# EAGLE schematic PlacaBase12V (EAGLE 7.3.0)
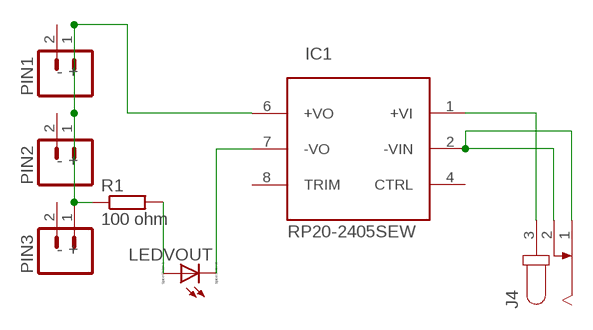
[diagram p0: schematic, sheet 1]

## Parts
IC1  RP20-2405SEW  [PACKAGE_RP20-2405SEW]
J4  JACK-PLUG1  [SPC4078]
LEDVOUT  LED_ELD260  [LED_LD260]
PIN1  M02PTH4  [1X02_XTRA_BIG]
PIN2  M02PTH4  [1X02_XTRA_BIG]
PIN3  M02PTH4  [1X02_XTRA_BIG]
R1  100 ohm  R-EU_0207/5V  [0207/5V]

## Nets
N$1: LEDVOUT.A R1.2
N$2: IC1.6(+VO) PIN1.1 PIN2.1 PIN3.1 R1.1
N$4: IC1.2(-VIN) J4.1 J4.2
N$5: IC1.7(-VO) LEDVOUT.K(C)
N$6: IC1.1(+VI) J4.3
Unconnected: IC1.4(CTRL) IC1.8(TRIM) PIN1.2 PIN2.2 PIN3.2

## Notes on the sheet
- - +
- - +
- - +

## Library data of the parts
IC1 = uchile_robotics_eagle_lib:RP20-2405SEW
J4 = con-jack:JACK-PLUG: DC POWER JACK Power Jack, DC, Right Angle, Through Hole, Rated 5A at 16VDC, PC Terminals Distributor: Farnell (www.Farnell.de) Drawing: 84N1161.pdf / 84N1162.pdf Manufacturer: SPC Technology (www.spctechnology.com) Type: SPC4077 / SPC 4078; OC_FARNELL: unknown; OC_NEWARK: unknown
LEDVOUT = eagle-ltspice:LED_E: LED Source: http://www.osram.convergy.de Source: www.luxeon.com Source: www.kingbright.com; SPICEMODEL: NONE; SPICEPREFIX: D; SPICETYPE: diode
PIN1-PIN3 = uchile_robotics_eagle_lib:M02: Standard 2-pin 0.1" header. Use with - straight break away headers ( PRT-00116) - right angle break away headers (PRT-00553) - swiss pins (PRT-00743) - machine pins (PRT-00117) - female headers (PRT-00115) Molex polarized connector foot print use with: PRT-08233 with associated crimp pins and housings. 2.54_SCREWTERM for use with PRT-10571. 3.5mm Screw Terminal footprints for PRT-08084 5mm Screw Terminal footprints for use with PRT-08432
R1 = rcl:R-EU_: RESISTOR, European symbol